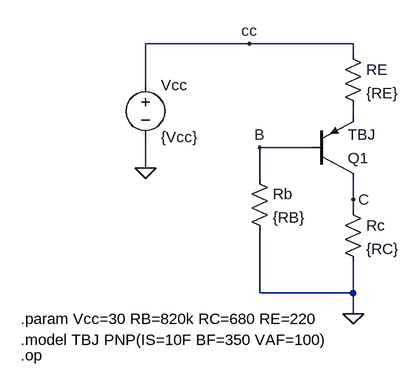
[diagram p0: schematic TBJPNP02CAop.asc]
TBJPNP02CAop.asc, the LTspice schematic file:
Version 4
SHEET 1 1608 1076
WIRE 128 -16 -32 -16
WIRE 288 -16 128 -16
WIRE 288 0 288 -16
WIRE -32 48 -32 -16
WIRE 288 96 288 80
WIRE 224 144 144 144
WIRE -32 176 -32 128
WIRE 144 192 144 144
WIRE 288 224 288 192
WIRE 288 240 288 224
WIRE 144 368 144 272
WIRE 288 368 288 320
WIRE 288 368 144 368
WIRE 288 400 288 368
FLAG -32 176 0
FLAG 288 400 0
FLAG 128 -16 cc
FLAG 144 144 B
FLAG 288 224 C
SYMBOL res 128 176 R0
SYMATTR InstName Rb
SYMATTR Value {RB}
SYMBOL res 272 224 R0
SYMATTR InstName Rc
SYMATTR Value {RC}
SYMBOL voltage -32 32 R0
WINDOW 123 0 0 Left 0
WINDOW 39 0 0 Left 0
SYMATTR InstName Vcc
SYMATTR Value {Vcc}
SYMBOL res 272 -16 R0
SYMATTR InstName RE
SYMATTR Value {RE}
SYMBOL pnp 224 192 M180
SYMATTR InstName Q1
SYMATTR Value TBJ
TEXT -224 408 Left 2 !.param Vcc=30 RB=820k RC=680 RE=220
TEXT -224 464 Left 2 !.op
TEXT -224 440 Left 2 !.model TBJ PNP(IS=10F BF=350 VAF=100)

The netlist it stands for:
* TBJPNP02CAop.asc
Rb B 0 {RB}
Rc C 0 {RC}
Vcc cc 0 {Vcc}
RE cc N001 {RE}
Q1 C B N001 0 TBJ
.model NPN NPN
.model PNP PNP
.lib standard.bjt
.param Vcc=30 RB=820k RC=680 RE=220
.op
.model TBJ PNP(IS=10F BF=350 VAF=100)
.backanno
.end